# Altium schematic sheet rf_main.SchDoc: mcHF Pro Transceiver RF board
size A3; Author: Krassi Atanassov; CompanyName: MØNKA; Engineer: For radio amateurs experimentation, non-commercial use only. Thank you!; Revision: 0.8.5; SheetTotal: 14
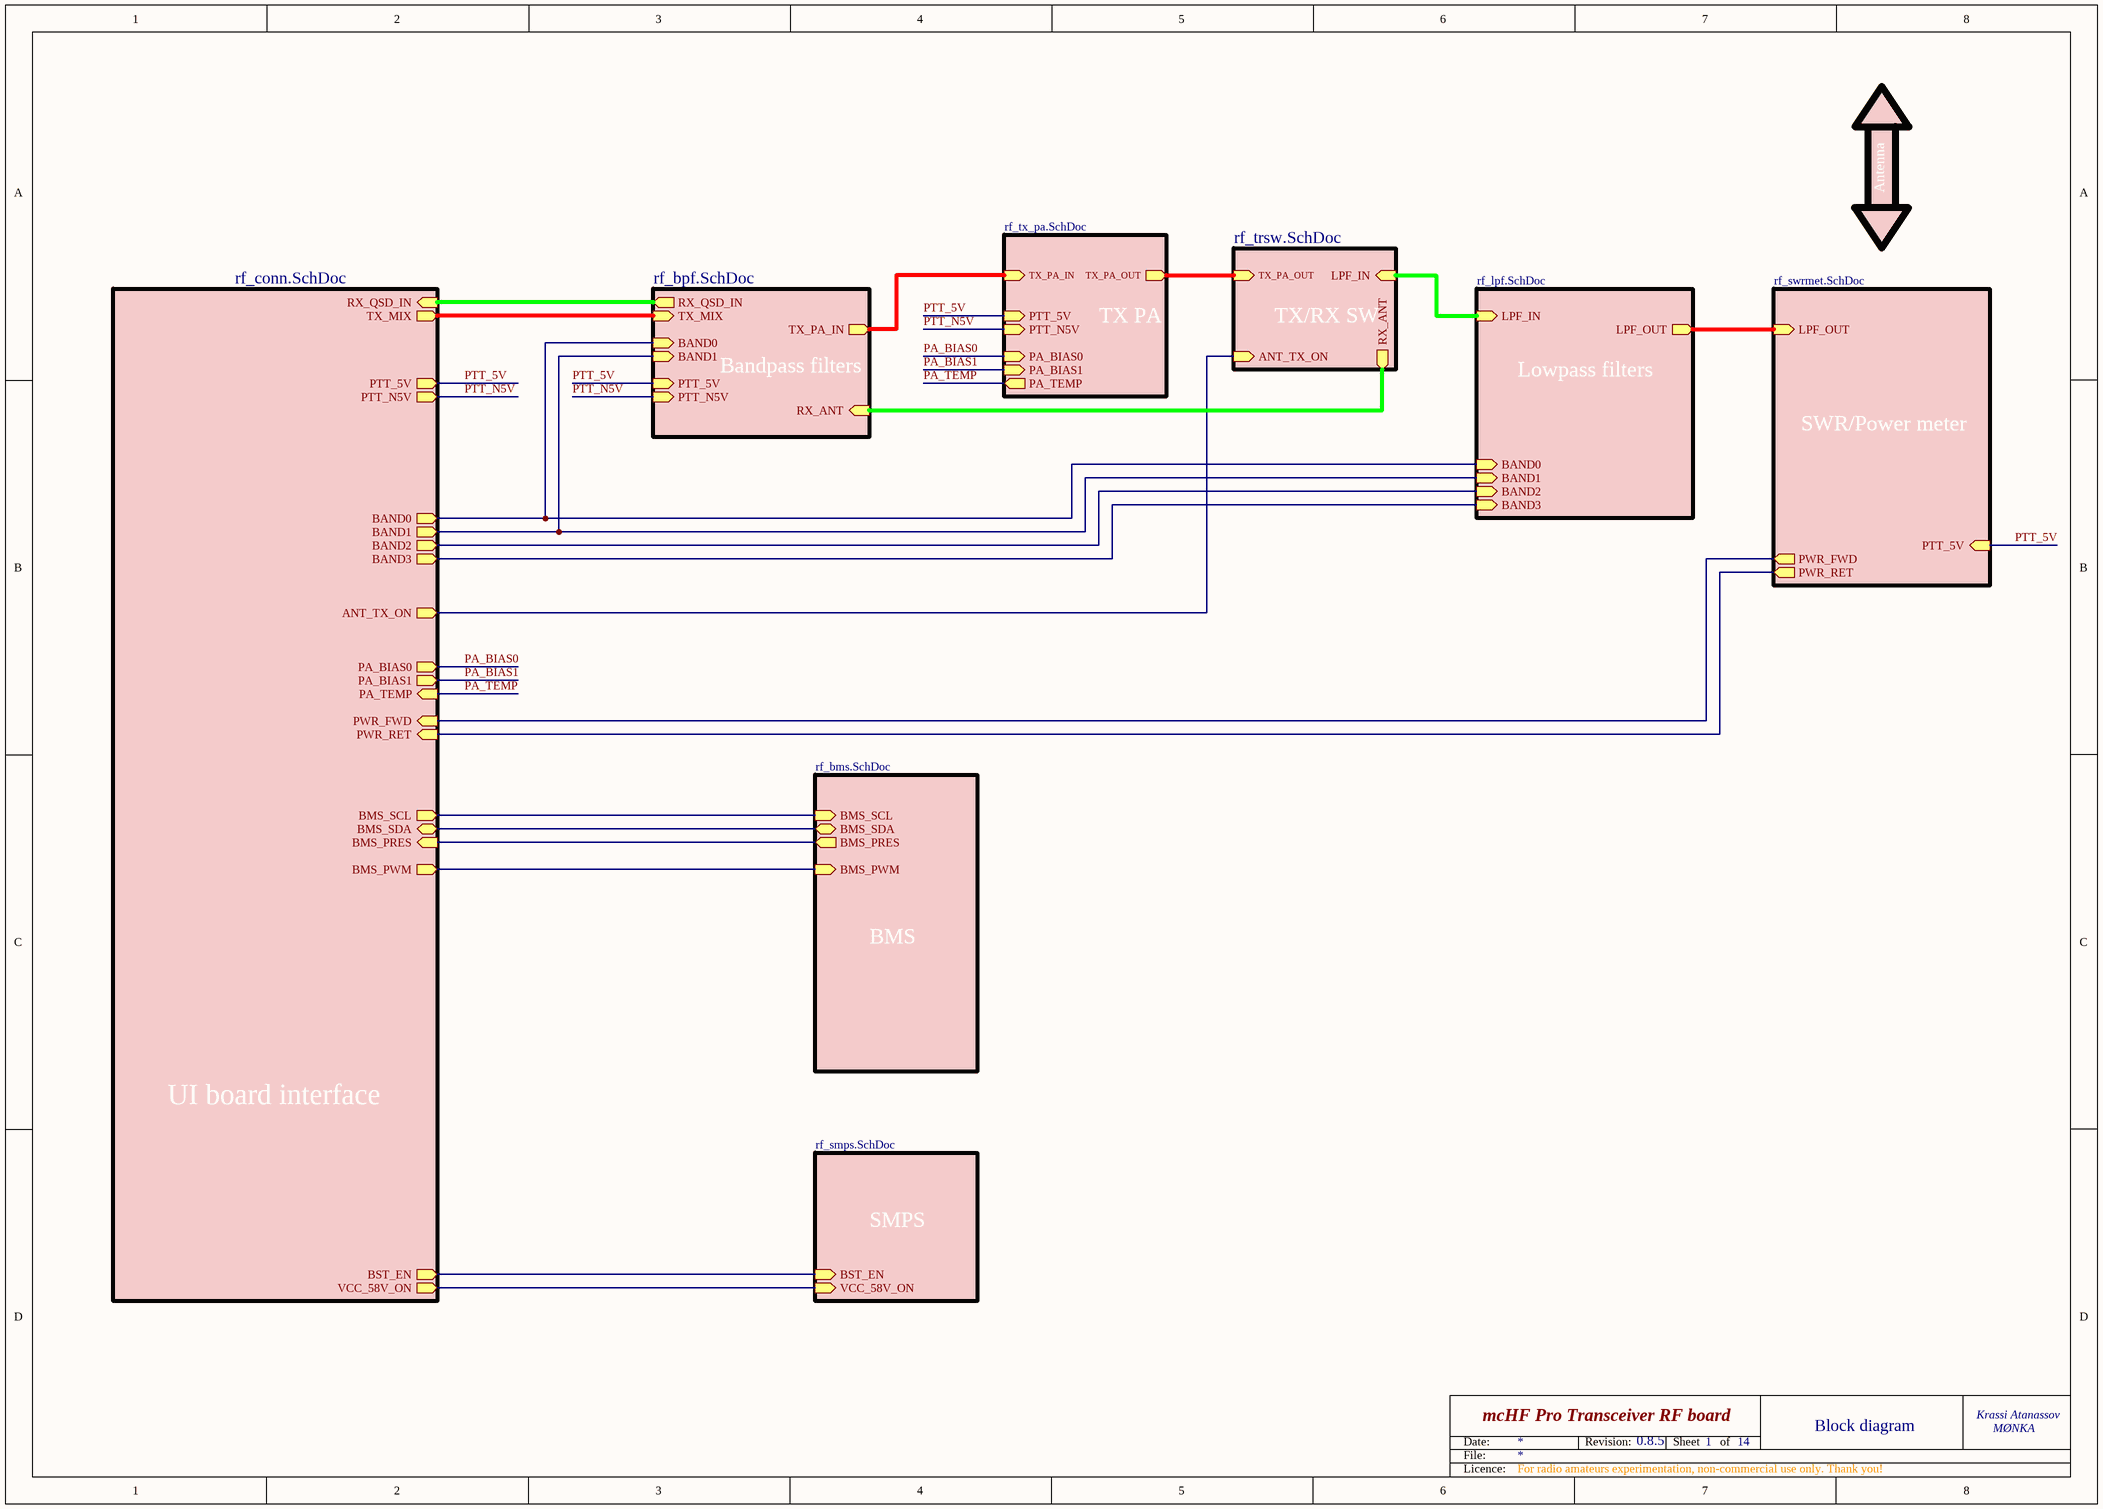
[diagram p0: rf_main.SchDoc]

## Sub-sheets
Bandpass filters = rf_bpf.SchDoc: BAND0 (in), BAND1 (in), PTT_5V (in), RX_ANT (in), TX_PA_IN (out), PTT_N5V (in), RX_QSD_IN (out), TX_MIX (in)
BMS = rf_bms.SchDoc: BMS_SCL (in), BMS_SDA (bidir), BMS_PRES (out), BMS_PWM (in)
Lowpass filters = rf_lpf.SchDoc: LPF_OUT (out), BAND0 (in), BAND1 (in), BAND2 (in), BAND3 (in), LPF_IN (in)
SMPS = rf_smps.SchDoc: VCC_58V_ON (in), BST_EN (in)
SWR/Power meter = rf_swrmet.SchDoc: LPF_OUT (in), PWR_FWD (out), PWR_RET (out), PTT_5V (in)
TX PA = rf_tx_pa.SchDoc: TX_PA_IN (in), PA_BIAS0 (in), TX_PA_OUT (out), PTT_N5V (in), PTT_5V (in), PA_BIAS1 (in), PA_TEMP (out)
TX/RX SW = rf_trsw.SchDoc: RX_ANT (out), ANT_TX_ON (in), LPF_IN (in), TX_PA_OUT (in)
UI board interface = rf_conn.SchDoc: PTT_5V (out), PTT_N5V (out), PWR_FWD (in), PWR_RET (in), PA_BIAS0 (out), BAND0 (out), BAND1 (out), BAND2 (out), ANT_TX_ON (out), BAND3 (out), RX_QSD_IN (in), TX_MIX (out), VCC_58V_ON (out), PA_BIAS1 (out), BMS_SCL (out), BMS_SDA (bidir), BMS_PRES (in), PA_TEMP (in), BMS_PWM (out), BST_EN (out)

## Nets
PA_BIAS0: sheet TX PA/PA_BIAS0, sheet UI board interface/PA_BIAS0
PA_BIAS1: sheet TX PA/PA_BIAS1, sheet UI board interface/PA_BIAS1
PA_TEMP: sheet TX PA/PA_TEMP, sheet UI board interface/PA_TEMP
PTT_5V: sheet TX PA/PTT_5V, sheet Bandpass filters/PTT_5V, sheet UI board interface/PTT_5V, sheet SWR/Power meter/PTT_5V
PTT_N5V: sheet TX PA/PTT_N5V, sheet Bandpass filters/PTT_N5V, sheet UI board interface/PTT_N5V
(unnamed): sheet TX PA/TX_PA_IN, sheet Bandpass filters/TX_PA_IN
(unnamed): sheet TX PA/TX_PA_OUT, sheet TX/RX SW/TX_PA_OUT
(unnamed): sheet Bandpass filters/BAND0, sheet Lowpass filters/BAND0, sheet UI board interface/BAND0
(unnamed): sheet Bandpass filters/BAND1, sheet Lowpass filters/BAND1, sheet UI board interface/BAND1
(unnamed): sheet Bandpass filters/RX_ANT, sheet TX/RX SW/RX_ANT
(unnamed): sheet Bandpass filters/RX_QSD_IN, sheet UI board interface/RX_QSD_IN
(unnamed): sheet Bandpass filters/TX_MIX, sheet UI board interface/TX_MIX
(unnamed): sheet Lowpass filters/LPF_OUT, sheet SWR/Power meter/LPF_OUT
(unnamed): sheet Lowpass filters/BAND2, sheet UI board interface/BAND2
(unnamed): sheet Lowpass filters/BAND3, sheet UI board interface/BAND3
(unnamed): sheet Lowpass filters/LPF_IN, sheet TX/RX SW/LPF_IN
(unnamed): sheet UI board interface/PWR_FWD, sheet SWR/Power meter/PWR_FWD
(unnamed): sheet UI board interface/PWR_RET, sheet SWR/Power meter/PWR_RET
(unnamed): sheet UI board interface/ANT_TX_ON, sheet TX/RX SW/ANT_TX_ON
(unnamed): sheet UI board interface/VCC_58V_ON, sheet SMPS/VCC_58V_ON
(unnamed): sheet UI board interface/BMS_SCL, sheet BMS/BMS_SCL
(unnamed): sheet UI board interface/BMS_SDA, sheet BMS/BMS_SDA
(unnamed): sheet UI board interface/BMS_PRES, sheet BMS/BMS_PRES
(unnamed): sheet UI board interface/BMS_PWM, sheet BMS/BMS_PWM
(unnamed): sheet UI board interface/BST_EN, sheet SMPS/BST_EN

## Notes on the sheet
- Antenna
- 1
- Block diagram
- Date:
- File:
- Revision:
- Sheet
- of
- Licence: